# Altium schematic sheet Port.SchDoc: Port
size A4; DocumentNumber: 2; SheetNumber: 2; SheetTotal: 5
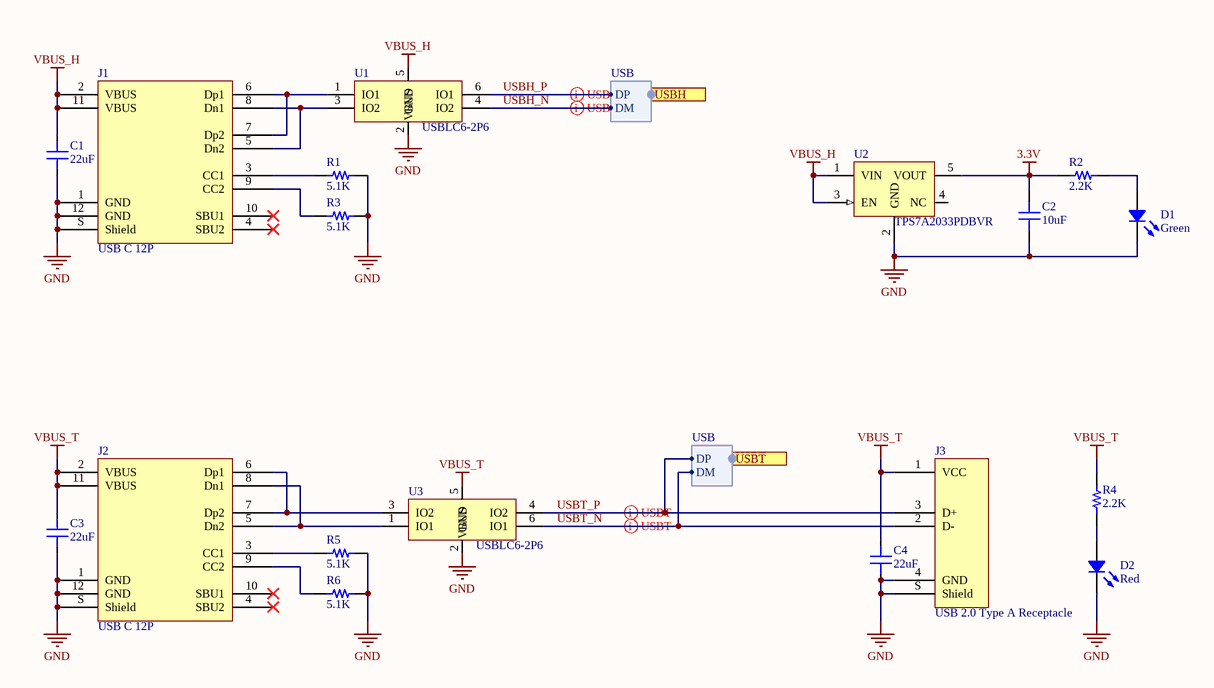
[diagram p0: Port.SchDoc]

## Parts
C1  22uF  [CAP 0805/2012]
C2  10uF  [CAP 0603/1608]
C3  22uF  [CAP 0805/2012]
C4  22uF  [CAP 0805/2012]
D1  Green  [LED 0603/1608 GREEN]
D2  Red  [LED 0603/1608 RED]
J1  USB C 12P  [JAE USB DX07S016JA1R1500]
J2  USB C 12P  [JAE USB DX07S016JA1R1500]
J3  USB 2.0 Type A Receptacle  [629104151021]
R1  5.1K  [RES 0402/1005]
R2  2.2K  [RES 0402/1005]
R3  5.1K  [RES 0402/1005]
R4  2.2K  [RES 0402/1005]
R5  5.1K  [RES 0402/1005]
R6  5.1K  [RES 0402/1005]
U1  USBLC6-2P6  [SOTFL50P160X60-6N]
U2  TPS7A2033PDBVR  [SOT95P280X110-5N]
U3  USBLC6-2P6  [SOTFL50P160X60-6N]

## Ports
USBH (harness USB), USBT (harness USB)

## Harnesses
USB: DP, DM

## Nets
3.3V: C2.2 R2.2 U2.5(VOUT)
GND: C1.1 C2.1 C3.1 C4.1 D1.2 D2.2 J1.1(GND) J1.12(GND) J1.S(Shield) J2.1(GND) J2.12(GND) J2.S(Shield) J3.4(GND) J3.S(Shield) R1.1 R3.1 R5.1 R6.1 U1.2(GND) U2.2(GND) U3.2(GND)
VBUS_H: C1.2 J1.2(VBUS) J1.11(VBUS) U1.5(VBUS) U2.1(VIN) U2.3(EN)
VBUS_T: C3.2 C4.2 J2.2(VBUS) J2.11(VBUS) J3.1(VCC) R4.1 U3.5(VBUS)
USBH_N: U1.4(IO2) ; port USBH.DM
USBH_P: U1.6(IO1) ; port USBH.DP
USBT_N: J3.2(D-) U3.6(IO1) ; port USBT.DM
USBT_P: J3.3(D+) U3.4(IO2) ; port USBT.DP
NetD1_1: D1.1 R2.1
NetD2_1: D2.1 R4.2
NetJ1_3: J1.3(CC1) R1.2
NetJ1_5: J1.5(Dn2) J1.8(Dn1) U1.3(IO2)
NetJ1_6: J1.6(Dp1) J1.7(Dp2) U1.1(IO1)
NetJ1_9: J1.9(CC2) R3.2
NetJ2_3: J2.3(CC1) R5.2
NetJ2_5: J2.5(Dn2) J2.8(Dn1) U3.1(IO1)
NetJ2_6: J2.6(Dp1) J2.7(Dp2) U3.3(IO2)
NetJ2_9: J2.9(CC2) R6.2

Not connected (* = marked no-connect by the designer): J1 4(SBU2)* 10(SBU1)*; J2 4(SBU2)* 10(SBU1)*; U2 4(NC)

## Layout directives
differential pair: USBH_N, USBH_P, USBT_N, USBT_P

## Notes on the sheet
- Title
- Size:
- Date:
- A4
- Number:
- Time:
- Revision:
- Sheet
- of
- File:

## Library data of the parts
C1 C3 C4 = CM1163: CAP CER 22UF 10V X5R 0805; Part Number: GRM219R61A226MEA0D; Manufacturer: Murata; TemperatureRange: -55C ~ 85C; Tolerance: 20%; Value: 22uF; PartId: CM1163; Supplier 1: Digi-Key; Supplier Part Number 1: 490-9951-2-ND; ComponentLink1Description: Datasheet; ComponentLink1URL: http://www.murata.com/~/media/webrenewal/support/library/catalog/products/capacitor/mlcc/c02e.pdf; ComponentLink2Description: Digi-Key Listing; ComponentLink2URL: https://www.digikey.com/product-detail/en/murata-electronics-north-america/GRM219R61A226MEA0D/490-9951-2-ND/4905417; TemperatureCoefficient: X5R; Voltage: 10V; Price: 0.0844; Device Package: 0805 (2012 Metric)
C2 = CM0905: CAP CER 10UF 25V X5R 0603; Part Number: GRM188R61E106MA73D; Manufacturer: Murata; TemperatureRange: -55C ~ 85C; Tolerance: 20%; Value: 10uF; PartId: CM0905; Supplier 1: Digi-Key; Supplier Part Number 1: 490-7202-2-ND; ComponentLink1Description: Datasheet; ComponentLink1URL: http://www.murata.com/~/media/webrenewal/support/library/catalog/products/capacitor/mlcc/c02e.pdf; ComponentLink2Description: Digi-Key Listing; ComponentLink2URL: https://www.digikey.com/product-detail/en/murata-electronics-north-america/GRM188R61E106MA73D/490-7202-2-ND/3900497; TemperatureCoefficient: X5R; Voltage: 25V; Price: 0.0858; Device Package: 0603 (1608 Metric)
D1 = LS0044: LED GREEN CLEAR 0603 SMD; Part Number: LTST-C191KGKT; Manufacturer: Lite-On Inc.; Type: Surface Mount; Millicandela: 35mcd; Voltage Forward: 2V; Current (Test): 20mA; Viewing Angle: 130; Value: Green; Colour: Green; PartId: LS0044; Supplier 1: Digi-Key; Supplier Part Number 1: 160-1446-2-ND; ComponentLink1Description: Datasheet; ComponentLink1URL: http://optoelectronics.liteon.com/upload/download/DS22-2000-228/LTST-C191KGKT.pdf; ComponentLink2Description: Digi-Key Listing; ComponentLink2URL: http://www.digikey.ca/product-detail/en/LTST-C191KGKT/160-1446-2-ND/386835; Price: 0.0521; Device Package: 0603 (1608 Metric); Lens Transparency: Clear
D2 = LS0043: LED RED CLEAR 0603 SMD; Part Number: LTST-C191KRKT; Manufacturer: Lite-On Inc.; Value: Green; Millicandela: 54mcd; Voltage Forward: 2V; Current (Test): 20mA; Viewing Angle: 130; Colour: Red; PartId: LS0043; Supplier 1: Digi-Key; Supplier Part Number 1: 160-1447-2-ND; ComponentLink1Description: Datasheet; ComponentLink1URL: http://optoelectronics.liteon.com/upload/download/DS22-2000-223/LTST-C191KRKT.pdf; ComponentLink2Description: Digi-Key Listing; ComponentLink2URL: http://www.digikey.ca/product-detail/en/LTST-C191KRKT/160-1447-2-ND/386837; Price: 0.0521; Device Package: 0603 (1608 Metric); Lens Transparency: Clear
J1 J2 = CU0055: USB 2.0 Type C, Receptacle, Horizontal, SMT; Part Number: DX07S016JA1R1500; Manufacturer: JAE; Number Of Positions: 12; PartId: CU0055; Supplier 1: Digi-Key; Supplier Part Number 1: 670-DX07S016JA1R1500CT-ND; ComponentLink1Description: Datasheet; ComponentLink1URL: https://www.jae.com/en/connectors/series/detail/product/id=91780&type_code=T1010; Supplier 2: Mouser; Supplier Part Number 2: 656-DX07S016JA1R1500; Type: USB - C
J3 = CU0022: USB 2.0 Type A, Receptacle, Horizontal, SMT, with Pegs; Manufacturer: Wurth; Number Of Positions: 4; PartId: CU0022; Part Number: 629104151021; Supplier 1: Mouser; Supplier Part Number 1: 710-629104151021; ComponentLink1Description: Datasheet; ComponentLink1URL: https://www.we-online.com/components/products/datasheet/629104151021.pdf; Type: USB - A
R1 R3 R5 R6 = RC1490: RES SMD 5.1K OHM 1% 1/16W 0402; Part Number: RC0402FR-075K1L; Manufacturer: Yageo; TemperatureRange: -55C ~ 155C; TemperatureCoefficient: 100ppm/C; PowerRating: 0.0625W, 1/16W; Value: 5.1K; PartId: RC1490; Supplier 1: Mouser; Supplier Part Number 1: 603-RC0402FR-075K1L; ComponentLink1Description: Datasheet; ComponentLink1URL: http://www.yageo.com/NewPortal/yageodocoutput?fileName=/pdf/R-Chip/PYu-RC_Group_51_RoHS_L_9.pdf; Tolerance: 1%; Price: 0.0043; Type: Thick Film; Device Package: 0402 (1005 Metric)
R2 R4 = RC1434: RES SMD 2.2K OHM 1% 1/16W 0402; Part Number: RC0402FR-072K2L; Manufacturer: Yageo; TemperatureRange: -55C ~ 155C; TemperatureCoefficient: 100ppm/C; PowerRating: 0.0625W, 1/16W; PartId: RC1434; Value: 2.2K; Supplier 1: Mouser; Supplier Part Number 1: 603-RC0402FR-072K2L; ComponentLink1Description: Datasheet; ComponentLink1URL: http://www.yageo.com/NewPortal/yageodocoutput?fileName=/pdf/R-Chip/PYu-RC_Group_51_RoHS_L_9.pdf; Tolerance: 1%; Price: 0.0043; Type: Thick Film; Device Package: 0402 (1005 Metric)
U1 U3 = IIF001: TVS ARRAY SOT666; Manufacturer: ST; PartId: IIF001; Part Number: USBLC6-2P6; Supplier 1: Digi-Key; Supplier Part Number 1: 497-5026-1-ND; Supplier 2: Farnell; Supplier Part Number 2: 1295310; ComponentLink1Description: Datasheet; ComponentLink1URL: http://www.st.com/resource/en/datasheet/usblc6-2.pdf; Price: 0.58; Type: ESD Diode; Device Package: SOTFL-6; Operating Temperature: -40C ~ 125C
U2 = URL111: LDO 3.3V 300MA SOT23-5; Manufacturer: TI; Input Voltage MAX: 5.5V; PartId: URL111; Part Number: TPS7A2033PDBVR; Supplier 1: Mouser; Supplier Part Number 1: 595-TPS7A2033PDBVR; ComponentLink1Description: Datasheet; ComponentLink1URL: https://www.ti.com/lit/ds/symlink/tps7a20.pdf; Price: 0.15; Type: LDO; Device Package: SOT23-5; Operating Temperature: -40C ~ 125C; Output Voltage: 3.3V; Output Current: 300mA